# Altium schematic sheet PhotoDetectors.SchDoc
size A4; SheetNumber: 6; SheetTotal: 7
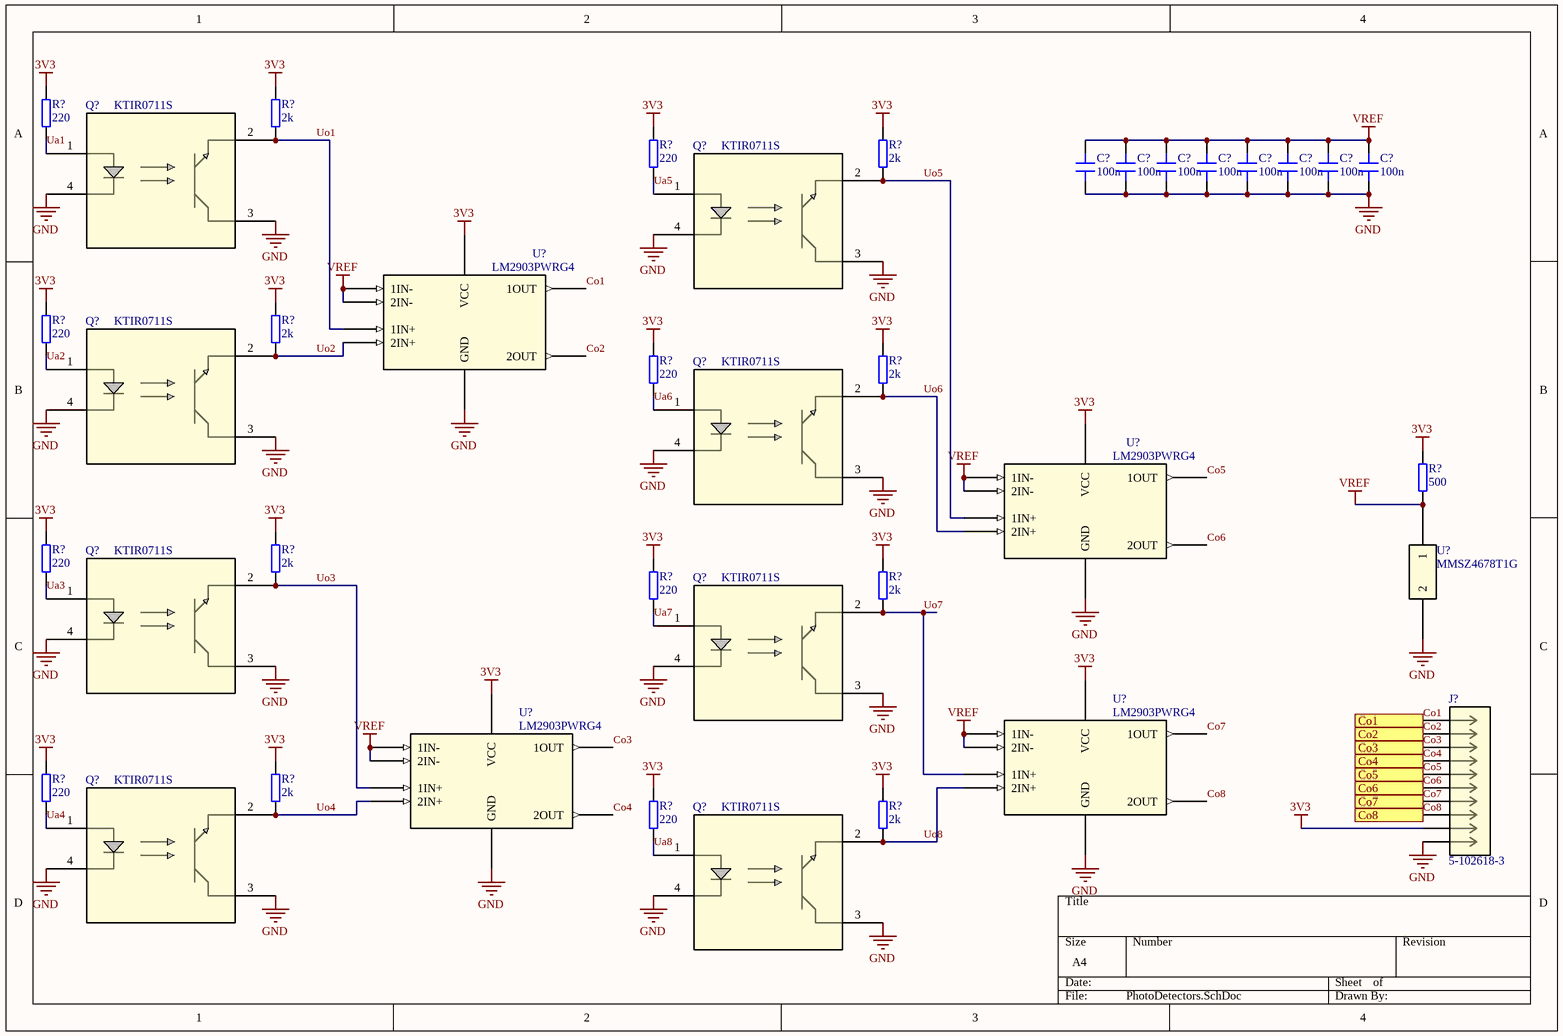
[diagram p0: PhotoDetectors.SchDoc]

## Parts
(Parts that share a designator on the sheet are numbered #1, #2 ... from top to bottom, then left to right.)
C?#1  100n
C?#2  100n
C?#3  100n
C?#4  100n
C?#5  100n
C?#6  100n
C?#7  100n
C?#8  100n
J?  5-102618-3  [CONN_102618-3_TEC]
Q?#1  KTIR0711S  [KTIR0711S_KNB]
Q?#2  KTIR0711S  [KTIR0711S_KNB]
Q?#3  KTIR0711S  [KTIR0711S_KNB]
Q?#4  KTIR0711S  [KTIR0711S_KNB]
Q?#5  KTIR0711S  [KTIR0711S_KNB]
Q?#6  KTIR0711S  [KTIR0711S_KNB]
Q?#7  KTIR0711S  [KTIR0711S_KNB]
Q?#8  KTIR0711S  [KTIR0711S_KNB]
R?#1  220
R?#2  2k
R?#3  220
R?#4  2k
R?#5  220
R?#6  2k
R?#7  220
R?#8  2k
R?#9  500
R?#10  220
R?#11  2k
R?#12  220
R?#13  2k
R?#14  220
R?#15  2k
R?#16  220
R?#17  2k
U?#1  LM2903PWRG4  [PW8]
U?#2  MMSZ4678T1G  [SOD_8T1G_ONS]
U?#3  LM2903PWRG4  [PW8]
U?#4  LM2903PWRG4  [PW8]
U?#5  LM2903PWRG4  [PW8]

## Ports
Co1 (out), Co2 (out), Co3 (out), Co4 (out), Co5 (out), Co6 (out), Co7 (out), Co8 (out)

## Nets
3V3: J?.9 R?#1.2 R?#2.2 R?#3.2 R?#4.2 R?#5.2 R?#6.2 R?#7.2 R?#8.2 R?#9.2 R?#10.2 R?#11.2 R?#12.2 R?#13.2 R?#14.2 R?#15.2 R?#16.2 R?#17.2 U?#1.8(VCC) U?#3.8(VCC) U?#4.8(VCC) U?#5.8(VCC)
GND: C?#1.1 C?#2.1 C?#3.1 C?#4.1 C?#5.1 C?#6.1 C?#7.1 C?#8.1 J?.10 Q?#1.3 Q?#1.4 Q?#2.3 Q?#2.4 Q?#3.3 Q?#3.4 Q?#4.3 Q?#4.4 Q?#5.3 Q?#5.4 Q?#6.3 Q?#6.4 Q?#7.3 Q?#7.4 Q?#8.3 Q?#8.4 U?#1.4(GND) U?#2.2 U?#3.4(GND) U?#4.4(GND) U?#5.4(GND)
VREF: C?#1.2 C?#2.2 C?#3.2 C?#4.2 C?#5.2 C?#6.2 C?#7.2 C?#8.2 R?#9.1 U?#1.2(1IN-) U?#1.6(2IN-) U?#2.1 U?#3.2(1IN-) U?#3.6(2IN-) U?#4.2(1IN-) U?#4.6(2IN-) U?#5.2(1IN-) U?#5.6(2IN-)
Co1: J?.1 U?#1.1(1OUT) ; port Co1
Co2: J?.2 U?#1.7(2OUT) ; port Co2
Co3: J?.3 U?#5.1(1OUT) ; port Co3
Co4: J?.4 U?#5.7(2OUT) ; port Co4
Co5: J?.5 U?#3.1(1OUT) ; port Co5
Co6: J?.6 U?#3.7(2OUT) ; port Co6
Co7: J?.7 U?#4.1(1OUT) ; port Co7
Co8: J?.8 U?#4.7(2OUT) ; port Co8
Ua1: Q?#1.1 R?#1.1
Ua2: Q?#3.1 R?#5.1
Ua3: Q?#5.1 R?#10.1
Ua4: Q?#7.1 R?#14.1
Ua5: Q?#2.1 R?#3.1
Ua6: Q?#4.1 R?#7.1
Ua7: Q?#6.1 R?#12.1
Ua8: Q?#8.1 R?#16.1
Uo1: Q?#1.2 R?#2.1 U?#1.3(1IN+)
Uo2: Q?#3.2 R?#6.1 U?#1.5(2IN+)
Uo3: Q?#5.2 R?#11.1 U?#5.3(1IN+)
Uo4: Q?#7.2 R?#15.1 U?#5.5(2IN+)
Uo5: Q?#2.2 R?#4.1 U?#3.3(1IN+)
Uo6: Q?#4.2 R?#8.1 U?#3.5(2IN+)
Uo7: Q?#6.2 R?#13.1 U?#4.3(1IN+)
Uo8: Q?#8.2 R?#17.1 U?#4.5(2IN+)

## Library data of the parts
C?#1-C?#8 = Capacitor: Value: *; HelpURL: *; MPN: *; Supplier: *; SupplierPartNumber: *
J? = 5-102618-3: No Description Available; Mfr_Name: TE Connectivity; Type: DEV; Copyright: Copyright (C) 2023 Ultra Librarian. All rights reserved.; Manufacturer_Part_Number: 5-102618-3; RefDes: RefDes
Q?#1-Q?#8 = KTIR0711S: No Description Available; Mfr_Name: Kingbright; Type: DEV; Copyright: Copyright (C) 2023 Ultra Librarian. All rights reserved.; Manufacturer_Part_Number: KTIR0711S; RefDes: RefDes
R?#1-R?#17 = Resistor: Value: *; HelpURL: *; MPN: *; Supplier: *; SupplierPartNumber: *
U?#1 U?#3-U?#5 = LM2903PWRG4: No Description Available; Mfr_Name: Texas Instruments; Copyright: Copyright (C) 2023 Ultra Librarian. All rights reserved.; Manufacturer_Part_Number: LM2903PWRG4; RefDes: RefDes; Type: DEV
U?#2 = MMSZ4678T1G: No Description Available; Mfr_Name: onsemi; Copyright: Copyright (C) 2023 Ultra Librarian. All rights reserved.; Manufacturer_Part_Number: MMSZ4678T1G; RefDes: RefDes; Type: DEV